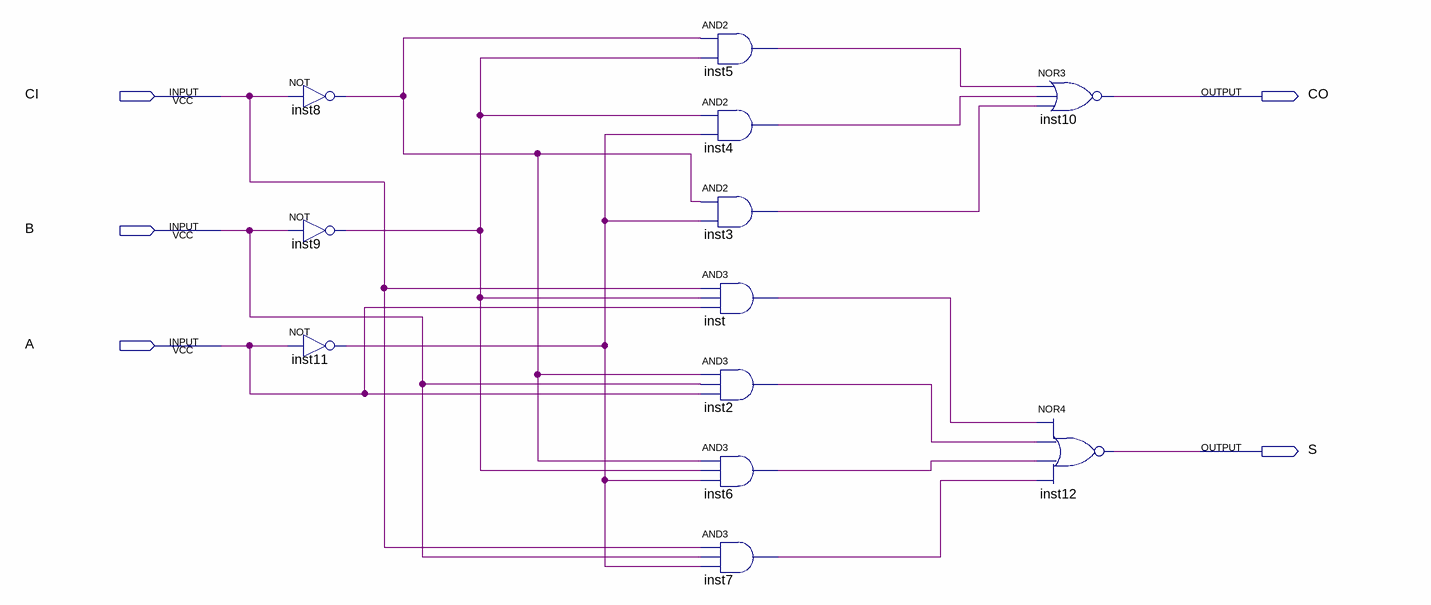
[diagram p0: schematic sheet]
// Quartus schematic 1unit_adder.bdf as structural Verilog: 12 symbols, 5 pins
module \1unit_adder  (
  input  CI,
  input  B,
  input  A,
  output CO,
  output S
);

  wire inst2_out, inst3_out, inst4_out, inst5_out, inst6_out, inst7_out, inst8_out, inst9_out, inst11_out,
       inst_out;

  not inst8 (inst8_out, CI);
  not inst9 (inst9_out, B);
  not inst11 (inst11_out, A);
  and inst5 (inst5_out, inst8_out, inst9_out);
  and inst4 (inst4_out, inst9_out, inst11_out);
  and inst3 (inst3_out, inst8_out, inst11_out);
  and inst (inst_out, CI, inst9_out, A);
  and inst2 (inst2_out, inst8_out, B, A);
  and inst6 (inst6_out, inst8_out, inst9_out, inst11_out);
  and inst7 (inst7_out, CI, B, inst11_out);
  nor inst10 (CO, inst5_out, inst4_out, inst3_out);
  nor inst12 (S, inst_out, inst2_out, inst6_out, inst7_out);
endmodule
